# Altium schematic sheet p4_pwr_misc.SchDoc
size OrCAD B; SheetNumber: 4; SheetTotal: 4
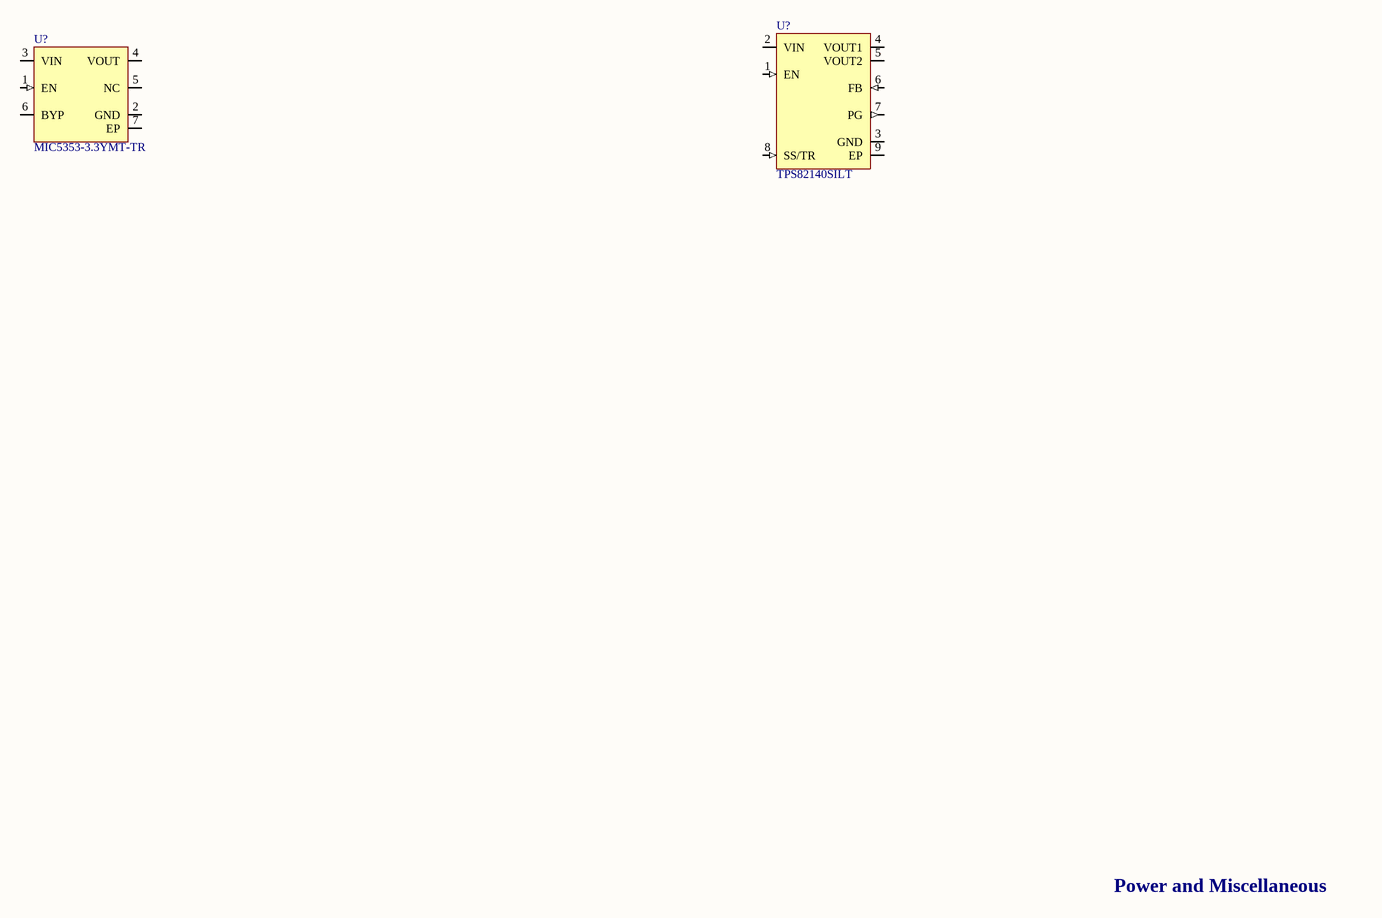
[diagram p0: p4_pwr_misc.SchDoc]

## Parts
(Parts that share a designator on the sheet are numbered #1, #2 ... from top to bottom, then left to right.)
U?#1  TPS82140SILT  [TI_USIL8_SIL0008D]
U?#2  MIC5353-3.3YMT-TR  [MCP_MLF6_MT]

## Nets

Not connected (* = marked no-connect by the designer): U?#1 1(EN) 2(VIN) 3(GND) 4(VOUT1) 5(VOUT2) 6(FB) 7(PG) 8(SS/TR) 9(EP); U?#2 1(EN) 2(GND) 3(VIN) 4(VOUT) 5(NC) 6(BYP) 7(EP)

## Notes on the sheet
- Power and Miscellaneous

## Library data of the parts
U?#1 = TPS82140SILT: STEP-DOWN CONVERTER MICROSIP; Manufacturer: Texas Instruments; Supplier 1: Digi-Key; Manufacturer Part Number: TPS82140SILT; Stock 1: 0; Min Operating Temperature: -40°C; Max Operating Temperature: 125°C; Supplier Part Number 1: 296-47089-1-ND
U?#2 = MIC5353-3.3YMT-TR: IC REG LINEAR 3.3V 500MA 6TMLF; Manufacturer: Microchip; Dropout Voltage: 160mV; Number of Regulators: 1; Min Current Limit: 600mA; Min Input Voltage: 2.6V; Max Input Voltage: 6V; Supplier 1: Digi-Key; Manufacturer Part Number: MIC5353-3.3YMT-TR; Stock 1: 24501; Pricing 1: 1=0.36, 25=0.294, 100=0.273 (USD); Number of Pins: 6; Min Operating Temperature: -40°C; Max Operating Temperature: 125°C; Packaging: Cut Tape; Output Voltage: 3.3V; Output Current: 500mA; Nominal Output Voltage: 3.3V; REACH SVHC: No SVHC; Lead Free: Lead Free; ComponentLink1URL: http://www.farnell.com/datasheets/1692673.pdf; ComponentLink1Description: http://www.farnell.com/datasheets/1692673.pdf; Supplier Part Number 1: 576-3680-1-ND